# Altium schematic sheet dsp_connection.SchDoc
size A4; SheetNumber: 6; SheetTotal: 9
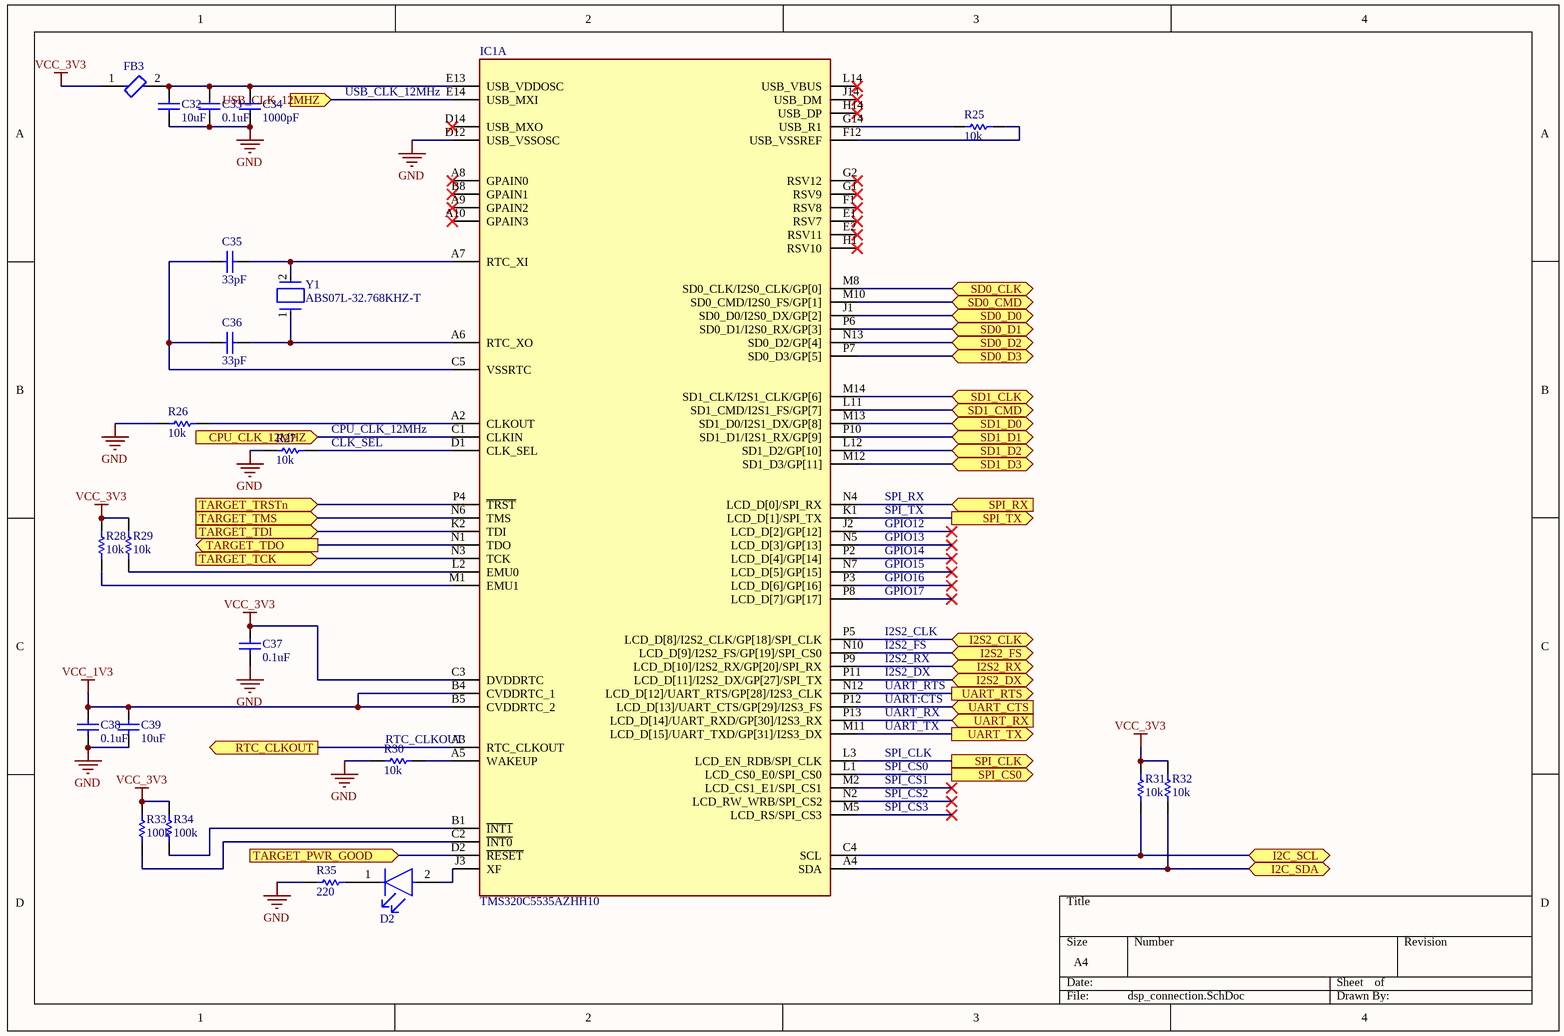
[diagram p0: dsp_connection.SchDoc]

## Parts
C32  10uF  [0805_C_S]
C33  0.1uF  [0805_C_S]
C34  1000pF  [0805_C_S]
C35  33pF  [0805_C_S]
C36  33pF  [0805_C_S]
C37  0.1uF  [0805_C_S]
C38  0.1uF  [0805_C_S]
C39  10uF  [0805_C_S]
D2  LTST-C150AKT  [FP-LTST-C150AKT-MFG]  (value not drawn)
FB3  BLM21AG151SN1D  [FP-BLM21-0_2-t0_85-e0_5-MFG]  (value not drawn)
IC1  TMS320C5535AZHH10  [BGA144C80P14X14_1200X1200X140]  (part A of 2)
R25  10k  [0805_R_S]
R26  10k  [0805_R_S]
R27  10k  [0805_R_S]
R28  10k  [0805_R_S]
R29  10k  [0805_R_S]
R30  10k  [0805_R_S]
R31  10k  [0805_R_S]
R32  10k  [0805_R_S]
R33  100k  [0805_R_S]
R34  100k  [0805_R_S]
R35  220  [0805_R_S]
Y1  ABS07L-32.768KHZ-T  [FP-ABS07L-MFG]

## Ports
CPU_CLK_12MHZ (in), I2C_SCL (bidir), I2C_SDA (bidir), I2S2_CLK (bidir), I2S2_DX (bidir), I2S2_FS (bidir), I2S2_RX (bidir), RTC_CLKOUT (out), SD0_CLK (bidir), SD0_CMD (bidir), SD0_D0 (bidir), SD0_D1 (bidir), SD0_D2 (bidir), SD0_D3 (bidir), SD1_CLK (bidir), SD1_CMD (bidir), SD1_D0 (bidir), SD1_D1 (bidir), SD1_D2 (bidir), SD1_D3 (bidir), SPI_CLK (out), SPI_CS0 (out), SPI_RX (in), SPI_TX (out), TARGET_PWR_GOOD (in), TARGET_TCK (in), TARGET_TDI (in), TARGET_TDO (out), TARGET_TMS (in), TARGET_TRSTn (in), UART_CTS (in), UART_RTS (out), UART_RX (in), UART_TX (out), USB_CLK_12MHZ (in)

## Nets
GND: C32.1 C33.1 C34.1 C37.1 C38.1 C39.1 IC1.D12(USB_VSSOSC) R26.1 R27.1 R30.1 R35.2
VCC_1V3: C38.2 C39.2 IC1.B4(CVDDRTC_1) IC1.B5(CVDDRTC_2)
VCC_3V3: C37.2 FB3.1 IC1.C3(DVDDRTC) R28.1 R29.1 R31.1 R32.1 R33.1 R34.1
CPU_CLK_12MHZ: IC1.C1(CLKIN) ; port CPU_CLK_12MHZ
I2C_SCL: IC1.C4(SCL) R31.2 ; port I2C_SCL
I2C_SDA: IC1.A4(SDA) R32.2 ; port I2C_SDA
I2S2_CLK: IC1.P5(LCD_D[8]/I2S2_CLK/GP[18]/SPI_CLK) ; port I2S2_CLK
I2S2_DX: IC1.P11(LCD_D[11]/I2S2_DX/GP[27]/SPI_TX) ; port I2S2_DX
I2S2_FS: IC1.N10(LCD_D[9]/I2S2_FS/GP[19]/SPI_CS0) ; port I2S2_FS
I2S2_RX: IC1.P9(LCD_D[10]/I2S2_RX/GP[20]/SPI_RX) ; port I2S2_RX
RTC_CLKOUT: IC1.A3(RTC_CLKOUT) ; port RTC_CLKOUT
SD0_CLK: IC1.M8(SD0_CLK/I2S0_CLK/GP[0]) ; port SD0_CLK
SD0_CMD: IC1.M10(SD0_CMD/I2S0_FS/GP[1]) ; port SD0_CMD
SD0_D0: IC1.J1(SD0_D0/I2S0_DX/GP[2]) ; port SD0_D0
SD0_D1: IC1.P6(SD0_D1/I2S0_RX/GP[3]) ; port SD0_D1
SD0_D2: IC1.N13(SD0_D2/GP[4]) ; port SD0_D2
SD0_D3: IC1.P7(SD0_D3/GP[5]) ; port SD0_D3
SD1_CLK: IC1.M14(SD1_CLK/I2S1_CLK/GP[6]) ; port SD1_CLK
SD1_CMD: IC1.L11(SD1_CMD/I2S1_FS/GP[7]) ; port SD1_CMD
SD1_D0: IC1.M13(SD1_D0/I2S1_DX/GP[8]) ; port SD1_D0
SD1_D1: IC1.P10(SD1_D1/I2S1_RX/GP[9]) ; port SD1_D1
SD1_D2: IC1.L12(SD1_D2/GP[10]) ; port SD1_D2
SD1_D3: IC1.M12(SD1_D3/GP[11]) ; port SD1_D3
SPI_CLK: IC1.L3(LCD_EN_RDB/SPI_CLK) ; port SPI_CLK
SPI_CS0: IC1.L1(LCD_CS0_E0/SPI_CS0) ; port SPI_CS0
SPI_RX: IC1.N4(LCD_D[0]/SPI_RX) ; port SPI_RX
SPI_TX: IC1.K1(LCD_D[1]/SPI_TX) ; port SPI_TX
TARGET_PWR_GOOD: IC1.D2(~{RESET}) ; port TARGET_PWR_GOOD
TARGET_TCK: IC1.N3(TCK) ; port TARGET_TCK
TARGET_TDI: IC1.K2(TDI) ; port TARGET_TDI
TARGET_TDO: IC1.N1(TDO) ; port TARGET_TDO
TARGET_TMS: IC1.N6(TMS) ; port TARGET_TMS
TARGET_TRSTn: IC1.P4(~{TRST}) ; port TARGET_TRSTn
UART_CTS: IC1.P12(LCD_D[13]/UART_CTS/GP[29]/I2S3_FS) ; port UART_CTS
UART_RTS: IC1.N12(LCD_D[12]/UART_RTS/GP[28]/I2S3_CLK) ; port UART_RTS
UART_RX: IC1.P13(LCD_D[14]/UART_RXD/GP[30]/I2S3_RX) ; port UART_RX
UART_TX: IC1.M11(LCD_D[15]/UART_TXD/GP[31]/I2S3_DX) ; port UART_TX
USB_CLK_12MHZ: IC1.E14(USB_MXI) ; port USB_CLK_12MHZ
NetC32_2: C32.2 C33.2 C34.2 FB3.2 IC1.E13(USB_VDDOSC)
NetC35_1: C35.1 C36.1 IC1.C5(VSSRTC)
NetC35_2: C35.2 IC1.A7(RTC_XI) Y1.2
NetC36_2: C36.2 IC1.A6(RTC_XO) Y1.1
NetD2_1: D2.1(C) R35.1
NetD2_2: D2.2(A) IC1.J3(XF)
NetIC1_A2: IC1.A2(CLKOUT) R26.2
NetIC1_A5: IC1.A5(WAKEUP) R30.2
NetIC1_B1: IC1.B1(~{INT1}) R34.2
NetIC1_C2: IC1.C2(~{INT0}) R33.2
NetIC1_D1: IC1.D1(CLK_SEL) R27.2
NetIC1_F12: IC1.F12(USB_VSSREF) R25.2
NetIC1_G14: IC1.G14(USB_R1) R25.1
NetIC1_L2: IC1.L2(EMU0) R29.2
NetIC1_M1: IC1.M1(EMU1) R28.2

Not connected (* = marked no-connect by the designer): IC1 A8(GPAIN0)* A9(GPAIN2)* A10(GPAIN3)* B8(GPAIN1)* D14(USB_MXO)* E1(RSV7)* E2(RSV11)* F1(RSV8)* G1(RSV9)* G2(RSV12)* H1(RSV10)* H14(USB_DP)* J2(LCD_D[2]/GP[12])* J14(USB_DM)* L14(USB_VBUS)* M2(LCD_CS1_E1/SPI_CS1)* M5(LCD_RS/SPI_CS3)* N2(LCD_RW_WRB/SPI_CS2)* N5(LCD_D[3]/GP[13])* N7(LCD_D[5]/GP[15])* P2(LCD_D[4]/GP[14])* P3(LCD_D[6]/GP[16])* P8(LCD_D[7]/GP[17])*

## Notes on the sheet
- USB_CLK_12MHz
- (near R27) CLK_SEL
- (near R27) CPU_CLK_12MHz
- SPI_RX
- SPI_TX
- GPIO12
- GPIO13
- GPIO14
- GPIO15
- GPIO16
- I2S2_CLK
- I2S2_FS
- GPIO17
- I2S2_RX
- I2S2_DX
- UART_RTS
- UART:CTS
- UART_RX
- (near R30) RTC_CLKOUT
- UART_TX
- SPI_CLK
- SPI_CS0
- SPI_CS1
- SPI_CS2
- SPI_CS3

## Library data of the parts
C32-C39 = Cap: Capacitor; Published: 8-Jun-2000; LatestRevisionDate: 17-Jul-2002; LatestRevisionNote: Re-released for DXP Platform.; Publisher: Altium Limited
  C32 C39: Value: 10uF
  C33 C37 C38: Value: 0.1uF
  C34: Value: 1000pF
  C35 C36: Value: 33pF
D2 = CMP-22017-000004-1: LED AMBER CLEAR SMD; Manufacturer: Lite-On; Luminous Intensity: 6mcd; Viewing Angle: 130°; Wavelength: 602nm; Reverse Voltage: 5V; Forward Current: 30mA; Led Orientation: Top View; Power Dissipation: 100mW; Peak Emmision Wavelength: 610nm; Forward Voltage: 2.1V; ComponentLink2Description: Datasheet; Device Class L3: unset; Height: 1.2mm; RoHS: TRUE; ComponentLink2URL: https://media.digikey.com/pdf/Data%20Sheets/Lite-On%20PDFs/LTST-C150AKT.pdf; Temperature: -55°C to +85°C; Package: 0; Automotive: No; Manufacturer Part Number: LTST-C150AKT; Temperature Range Low: -55°C; Device Class L2: LEDs; Device Class L1: Optoelectronics; Octopart: https://octopart.com/ltst-c150akt-lite-on-549804; Digikey Description: LED AMBER CLEAR SMD; Colour: Amber; Category: Diode; Mouser Description: Standard LEDs - SMD Amber Clear 602nm; Lead Free: Yes; Temperature Range High: +85°C
FB3 = CMP-0686-00717-3: Chip Ferrite Bead, 0805, 150Ω @ 100MHz, 0.09Ω, 25%, 1A; Number of Circuits: 1; Max Current Rating: 800mA; DC Resistance (DCR): 100mR; Shielding: Unshielded; DC Current: 200mA; Impedance: 150R; Contact Plating: Tin; Weight: 0.000194oz; Series: EMIFIL®, BLM21A; Core Material: Ferrite; Test Frequency: 100MHz; Case Code (Metric): 2012; Package Quantity: 4000; Lead Free: Lead Free; Max Operating Temperature: 125°C; Case Code (Imperial): 0805; Material: Ferrite; Min Operating Temperature: -55°C; Tolerance: 25%; Length: 2mm; DC Resistance-Max: 100mR; Width: 1.25mm; RoHS Compliant: Yes; Packaging: Tape and Reel; REACH SVHC: No SVHC; Depth: 1.45mm; Number of Pins: 2; Radiation Hardening: No; Current Rating: 800mA; Height: 0.85mm; Termination: SMD/SMT; Number of Lines: 1; Max DC Current: 200mA; Case/Package: 0805
IC1 = TMS320C5535AZHH10: Integrated Circuit; Manufacturer_Name: Texas Instruments; Datasheet Link: https://www.ti.com/lit/ds/symlink/tms320c5535.pdf?ts=1611725836718&ref_url=https%253A%252F%252Fwww.ti.com%252Fstore%252Fti%252Fen%252Fp%252Fproduct%252F%253Fp%253DTMS320C5535AZAY10; Height: 1.4mm; Manufacturer_Part_Number: TMS320C5535AZHH10; Mouser Part Number: 595-MS320C5535AZHH10; Mouser Price/Stock: https://www.mouser.co.uk/ProductDetail/Texas-Instruments/TMS320C5535AZHH10/?qs=bdKHSS5iKg4ejDTN3zE2OA%3D%3D; Arrow Part Number: TMS320C5535AZHH10; Arrow Price/Stock: https://www.arrow.com/en/products/tms320c5535azhh10/texas-instruments
R25-R35 = Res1: Resistor; Published: 8-Jun-2000; LatestRevisionDate: 17-Jul-2002; LatestRevisionNote: Re-released for DXP Platform.; Publisher: Altium Limited
  R25-R32: Value: 10k
  R33 R34: Value: 100k
  R35: Value: 220
Y1 = CMP-27762-003010-1: CRYSTAL 32.7680KHZ 12.5PF SMD; Series Resistance: 55kR; Tolerance: 20ppm; Max Operating Temperature: 85°C; Min Operating Temperature: -40°C; Series: ABS07L; Package Quantity: 1; Lead Free: Lead Free; Load Capacitance: 12.5pF; Packaging: Tape and Reel; Frequency: 32.768kHz; Height: 0.015inch; Number of Pins: 2; Length: 0.126inch; Width: 0.059inch; Termination: SMD/SMT; RoHS Compliant: Yes; Mount: Surface Mount; Radiation Hardening: No; Case/Package: SMD/SMT; ESR (Equivalent Series Resistance): 55kR; Frequency Tolerance: 20ppm